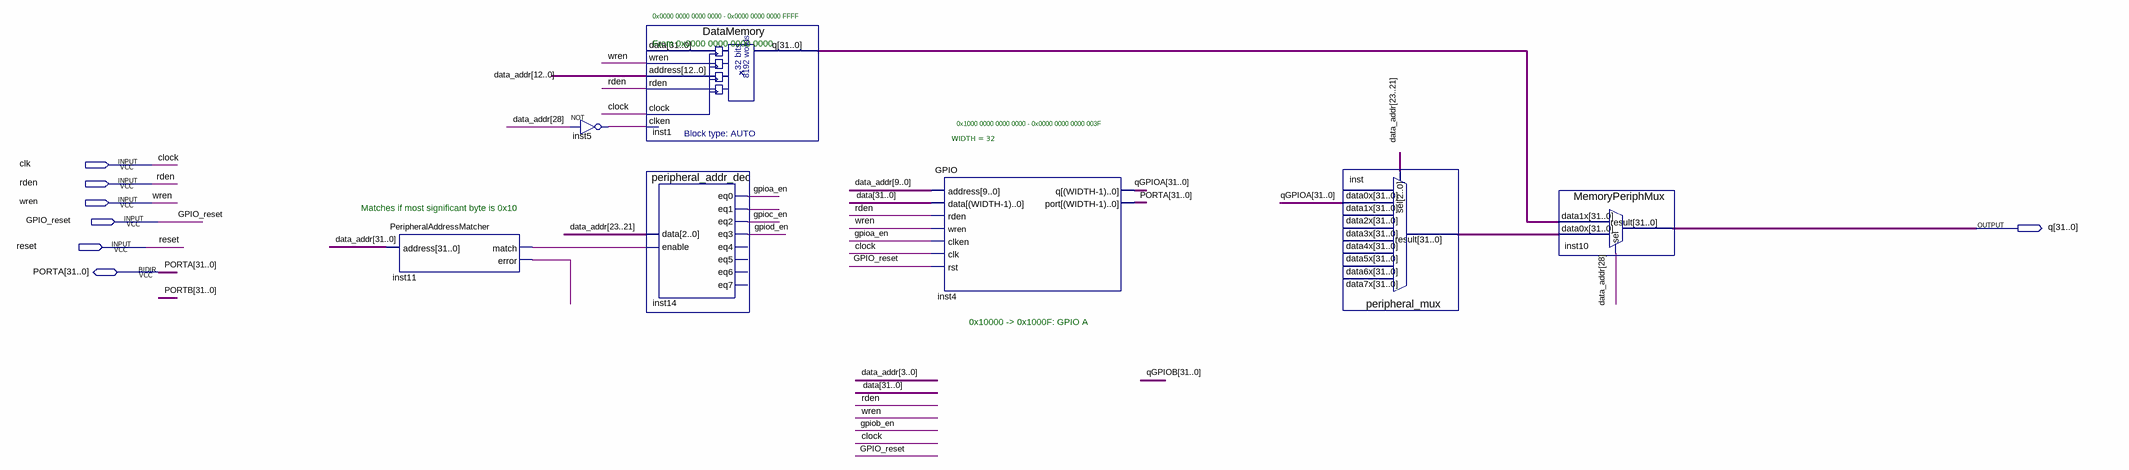
[diagram p0: schematic sheet]
// Quartus schematic peripheral_and_memory_block_no borrar por favore.bdf as structural Verilog: 7 symbols, 7 pins
module \peripheral_and_memory_block_no_borrar_por_favore  (
  input  clk,
  input  rden,
  input  wren,
  input  GPIO_reset,
  input  reset,
  inout  [31:0] PORTA,
  output [31:0] q
);

  wire gpioa_en, gpioc_en, gpiod_en, inst5_out, inst11_error, inst11_match, inst14_eq1;
  wire [31:0] data, data_addr, inst1_q, inst_result, qGPIOA;

  PeripheralAddressMatcher inst11 (.address(data_addr), .match(inst11_match), .error(inst11_error));
  not inst5 (inst5_out, data_addr[28]);
  DataMemory inst1 (
    .wren(wren), .address(data_addr[12:0]), .rden(rden), .clock(clk), .clken(inst5_out), .q(inst1_q));  // open: data
  peripheral_addr_dec inst14 (
    .data(data_addr[23:21]), .enable(inst11_match), .eq0(gpioa_en), .eq1(inst14_eq1), .eq2(gpioc_en),
    .eq3(gpiod_en));  // open: eq4, eq5, eq6, eq7
  GPIO #(.WIDTH(32)) inst4 (
    .address(data_addr[9:0]), .data(data), .rden(rden), .wren(wren), .clken(gpioa_en), .clk(clk),
    .rst(GPIO_reset), .q(qGPIOA), .port(PORTA));
  peripheral_mux inst (
    .data1x(qGPIOA), .sel(data_addr[23:21]), .result(inst_result));  // open: data7x, data6x, data5x, data4x, data3x, data2x, data0x
  MemoryPeriphMux inst10 (.data1x(inst1_q), .data0x(inst_result), .sel(data_addr[28]), .result(q));

  // Other names for the same wires on the sheet: clock = clk

  // Notes on the sheet:
  //   0x0000 0000 0000 0000 - 0x0000 0000 0000 FFFF
  //   From 0x0000 0000 0000 0000
  //   0x1000 0000 0000 0000 - 0x0000 0000 0000 003F
  //   Matches if most significant byte is 0x10
  //   0x10000 -> 0x1000F: GPIO A
endmodule
